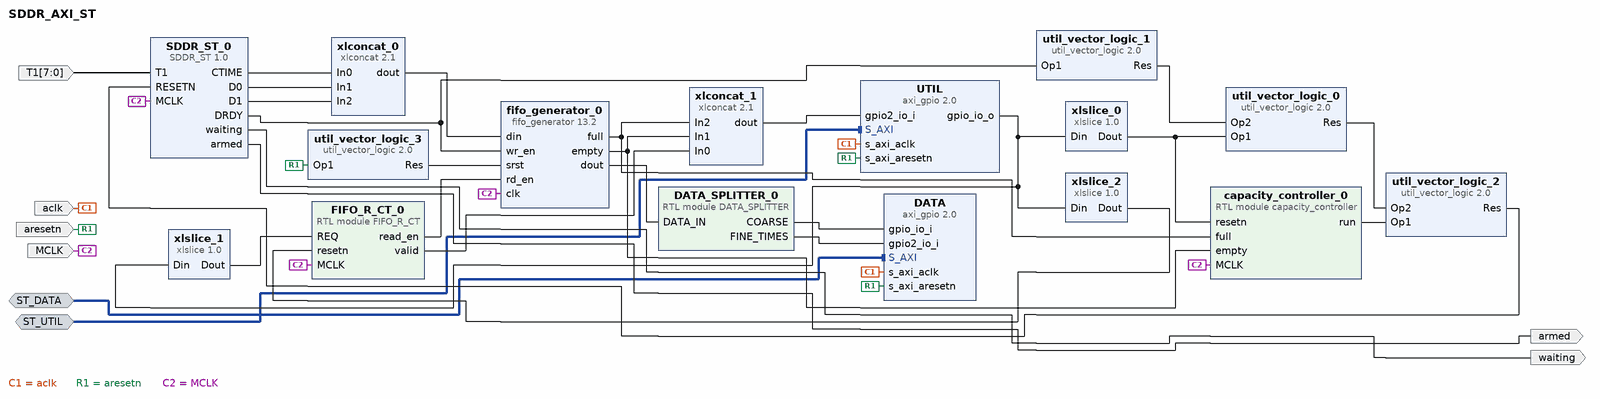
[diagram p0: block diagram of the top level]
# Vivado block design SDDR_AXI_ST, xc7z020clg400-1, Vivado 2019.1
create_bd_design SDDR_AXI_ST

create_bd_intf_port -mode Slave -vlnv xilinx.com:interface:aximm_tlm:1.0 ST_DATA
create_bd_intf_port -mode Slave -vlnv xilinx.com:interface:aximm_tlm:1.0 ST_UTIL
create_bd_port -dir I -from 7 -to 0 T1
create_bd_port -dir I -type clk MCLK
set_property -dict {CONFIG.FREQ_HZ 400000000} [get_bd_ports MCLK]
create_bd_port -dir I -type clk aclk
set_property -dict {CONFIG.FREQ_HZ 100000000} [get_bd_ports aclk]
create_bd_port -dir I -type rst aresetn
create_bd_port -dir O waiting
create_bd_port -dir O armed

create_bd_cell -type ip -vlnv xilinx.com:ip:axi_gpio:2.0 DATA
set_property -dict {CONFIG.C_ALL_INPUTS 1 CONFIG.C_ALL_INPUTS_2 1 CONFIG.C_GPIO2_WIDTH 16 CONFIG.C_IS_DUAL 1} [get_bd_cells DATA]
create_bd_cell -type ip -vlnv xilinx.com:ip:axi_gpio:2.0 UTIL
set_property -dict [list \
  CONFIG.C_ALL_INPUTS 0 \
  CONFIG.C_ALL_INPUTS_2 1 \
  CONFIG.C_ALL_OUTPUTS 1 \
  CONFIG.C_GPIO2_WIDTH 3 \
  CONFIG.C_GPIO_WIDTH 3 \
  CONFIG.C_IS_DUAL 1 \
] [get_bd_cells UTIL]
create_bd_cell -type ip -vlnv cri.nz:user:SDDR_ST:1.0 SDDR_ST_0
set_property -dict {CONFIG.SIG_WIDTH 8} [get_bd_cells SDDR_ST_0]
create_bd_cell -type ip -vlnv xilinx.com:ip:util_vector_logic:2.0 util_vector_logic_0
set_property -dict {CONFIG.C_SIZE 1} [get_bd_cells util_vector_logic_0]
create_bd_cell -type ip -vlnv xilinx.com:ip:util_vector_logic:2.0 util_vector_logic_1
set_property -dict {CONFIG.C_OPERATION not CONFIG.C_SIZE 1} [get_bd_cells util_vector_logic_1]
create_bd_cell -type ip -vlnv xilinx.com:ip:fifo_generator:13.2 fifo_generator_0
set_property -dict [list \
  CONFIG.Data_Count true \
  CONFIG.Data_Count_Width 11 \
  CONFIG.Input_Data_Width 48 \
  CONFIG.Input_Depth 2048 \
  CONFIG.Output_Data_Width 48 \
  CONFIG.Valid_Flag true \
  CONFIG.Write_Acknowledge_Flag true \
] [get_bd_cells fifo_generator_0]
create_bd_cell -type module -reference capacity_controller capacity_controller_0
create_bd_cell -type ip -vlnv xilinx.com:ip:util_vector_logic:2.0 util_vector_logic_2
set_property -dict {CONFIG.C_SIZE 1} [get_bd_cells util_vector_logic_2]
create_bd_cell -type module -reference FIFO_R_CT FIFO_R_CT_0
create_bd_cell -type ip -vlnv xilinx.com:ip:xlslice:1.0 xlslice_0
set_property -dict {CONFIG.DIN_FROM 0 CONFIG.DIN_TO 0 CONFIG.DIN_WIDTH 3} [get_bd_cells xlslice_0]
create_bd_cell -type ip -vlnv xilinx.com:ip:xlslice:1.0 xlslice_1
set_property -dict {CONFIG.DIN_FROM 1 CONFIG.DIN_TO 1 CONFIG.DIN_WIDTH 3 CONFIG.DOUT_WIDTH 1} [get_bd_cells xlslice_1]
create_bd_cell -type ip -vlnv xilinx.com:ip:xlslice:1.0 xlslice_2
set_property -dict {CONFIG.DIN_FROM 2 CONFIG.DIN_TO 2 CONFIG.DIN_WIDTH 3 CONFIG.DOUT_WIDTH 1} [get_bd_cells xlslice_2]
create_bd_cell -type ip -vlnv xilinx.com:ip:xlconcat:2.1 xlconcat_0
set_property -dict {CONFIG.IN0_WIDTH 32 CONFIG.IN1_WIDTH 8 CONFIG.IN2_WIDTH 8 CONFIG.NUM_PORTS 3} [get_bd_cells xlconcat_0]
create_bd_cell -type module -reference DATA_SPLITTER DATA_SPLITTER_0
create_bd_cell -type ip -vlnv xilinx.com:ip:xlconcat:2.1 xlconcat_1
set_property -dict {CONFIG.NUM_PORTS 3} [get_bd_cells xlconcat_1]
create_bd_cell -type ip -vlnv xilinx.com:ip:util_vector_logic:2.0 util_vector_logic_3
set_property -dict {CONFIG.C_OPERATION not CONFIG.C_SIZE 1} [get_bd_cells util_vector_logic_3]

# ---- connections ----

connect_bd_intf_net [get_bd_intf_ports ST_DATA] [get_bd_intf_pins DATA/S_AXI]
connect_bd_intf_net [get_bd_intf_ports ST_UTIL] [get_bd_intf_pins UTIL/S_AXI]
connect_bd_net [get_bd_ports aclk] [get_bd_pins UTIL/s_axi_aclk] [get_bd_pins DATA/s_axi_aclk]
connect_bd_net [get_bd_ports aresetn] [get_bd_pins DATA/s_axi_aresetn] [get_bd_pins UTIL/s_axi_aresetn] [get_bd_pins util_vector_logic_3/Op1]
connect_bd_net -net T1_1 [get_bd_ports T1] [get_bd_pins SDDR_ST_0/T1]
connect_bd_net -net UTIL_gpio_io_o [get_bd_pins xlslice_0/Dout] [get_bd_pins util_vector_logic_0/Op1] [get_bd_pins capacity_controller_0/resetn]
connect_bd_net [get_bd_pins SDDR_ST_0/DRDY] [get_bd_pins util_vector_logic_1/Op1] [get_bd_pins fifo_generator_0/wr_en]
connect_bd_net [get_bd_pins util_vector_logic_1/Res] [get_bd_pins util_vector_logic_0/Op2]
connect_bd_net [get_bd_ports MCLK] \
  [get_bd_pins SDDR_ST_0/MCLK] [get_bd_pins capacity_controller_0/MCLK] [get_bd_pins FIFO_R_CT_0/MCLK] \
  [get_bd_pins fifo_generator_0/clk]
connect_bd_net [get_bd_pins SDDR_ST_0/waiting] [get_bd_ports waiting]
connect_bd_net [get_bd_pins SDDR_ST_0/armed] [get_bd_ports armed]
connect_bd_net [get_bd_pins util_vector_logic_0/Res] [get_bd_pins util_vector_logic_2/Op2]
connect_bd_net [get_bd_pins capacity_controller_0/run] [get_bd_pins util_vector_logic_2/Op1]
connect_bd_net [get_bd_pins util_vector_logic_2/Res] [get_bd_pins SDDR_ST_0/RESETN]
connect_bd_net [get_bd_pins fifo_generator_0/full] [get_bd_pins capacity_controller_0/full] [get_bd_pins xlconcat_1/In2]
connect_bd_net [get_bd_pins fifo_generator_0/empty] [get_bd_pins capacity_controller_0/empty] [get_bd_pins xlconcat_1/In1]
connect_bd_net [get_bd_pins FIFO_R_CT_0/read_en] [get_bd_pins fifo_generator_0/rd_en]
connect_bd_net [get_bd_pins UTIL/gpio_io_o] [get_bd_pins xlslice_0/Din] [get_bd_pins xlslice_1/Din] [get_bd_pins xlslice_2/Din]
connect_bd_net [get_bd_pins xlslice_1/Dout] [get_bd_pins FIFO_R_CT_0/REQ]
connect_bd_net [get_bd_pins xlslice_2/Dout] [get_bd_pins FIFO_R_CT_0/resetn]
connect_bd_net [get_bd_pins xlconcat_0/dout] [get_bd_pins fifo_generator_0/din]
connect_bd_net [get_bd_pins SDDR_ST_0/CTIME] [get_bd_pins xlconcat_0/In0]
connect_bd_net [get_bd_pins SDDR_ST_0/D0] [get_bd_pins xlconcat_0/In1]
connect_bd_net [get_bd_pins SDDR_ST_0/D1] [get_bd_pins xlconcat_0/In2]
connect_bd_net [get_bd_pins fifo_generator_0/dout] [get_bd_pins DATA_SPLITTER_0/DATA_IN]
connect_bd_net [get_bd_pins DATA_SPLITTER_0/COARSE] [get_bd_pins DATA/gpio_io_i]
connect_bd_net [get_bd_pins DATA_SPLITTER_0/FINE_TIMES] [get_bd_pins DATA/gpio2_io_i]
connect_bd_net [get_bd_pins xlconcat_1/dout] [get_bd_pins UTIL/gpio2_io_i]
connect_bd_net [get_bd_pins FIFO_R_CT_0/valid] [get_bd_pins xlconcat_1/In0]
connect_bd_net [get_bd_pins util_vector_logic_3/Res] [get_bd_pins fifo_generator_0/srst]

validate_bd_design
save_bd_design
